# Altium schematic sheet USB_OTG_AND_HOST.SchDoc
size A3; SheetNumber: 2; SheetTotal: 20
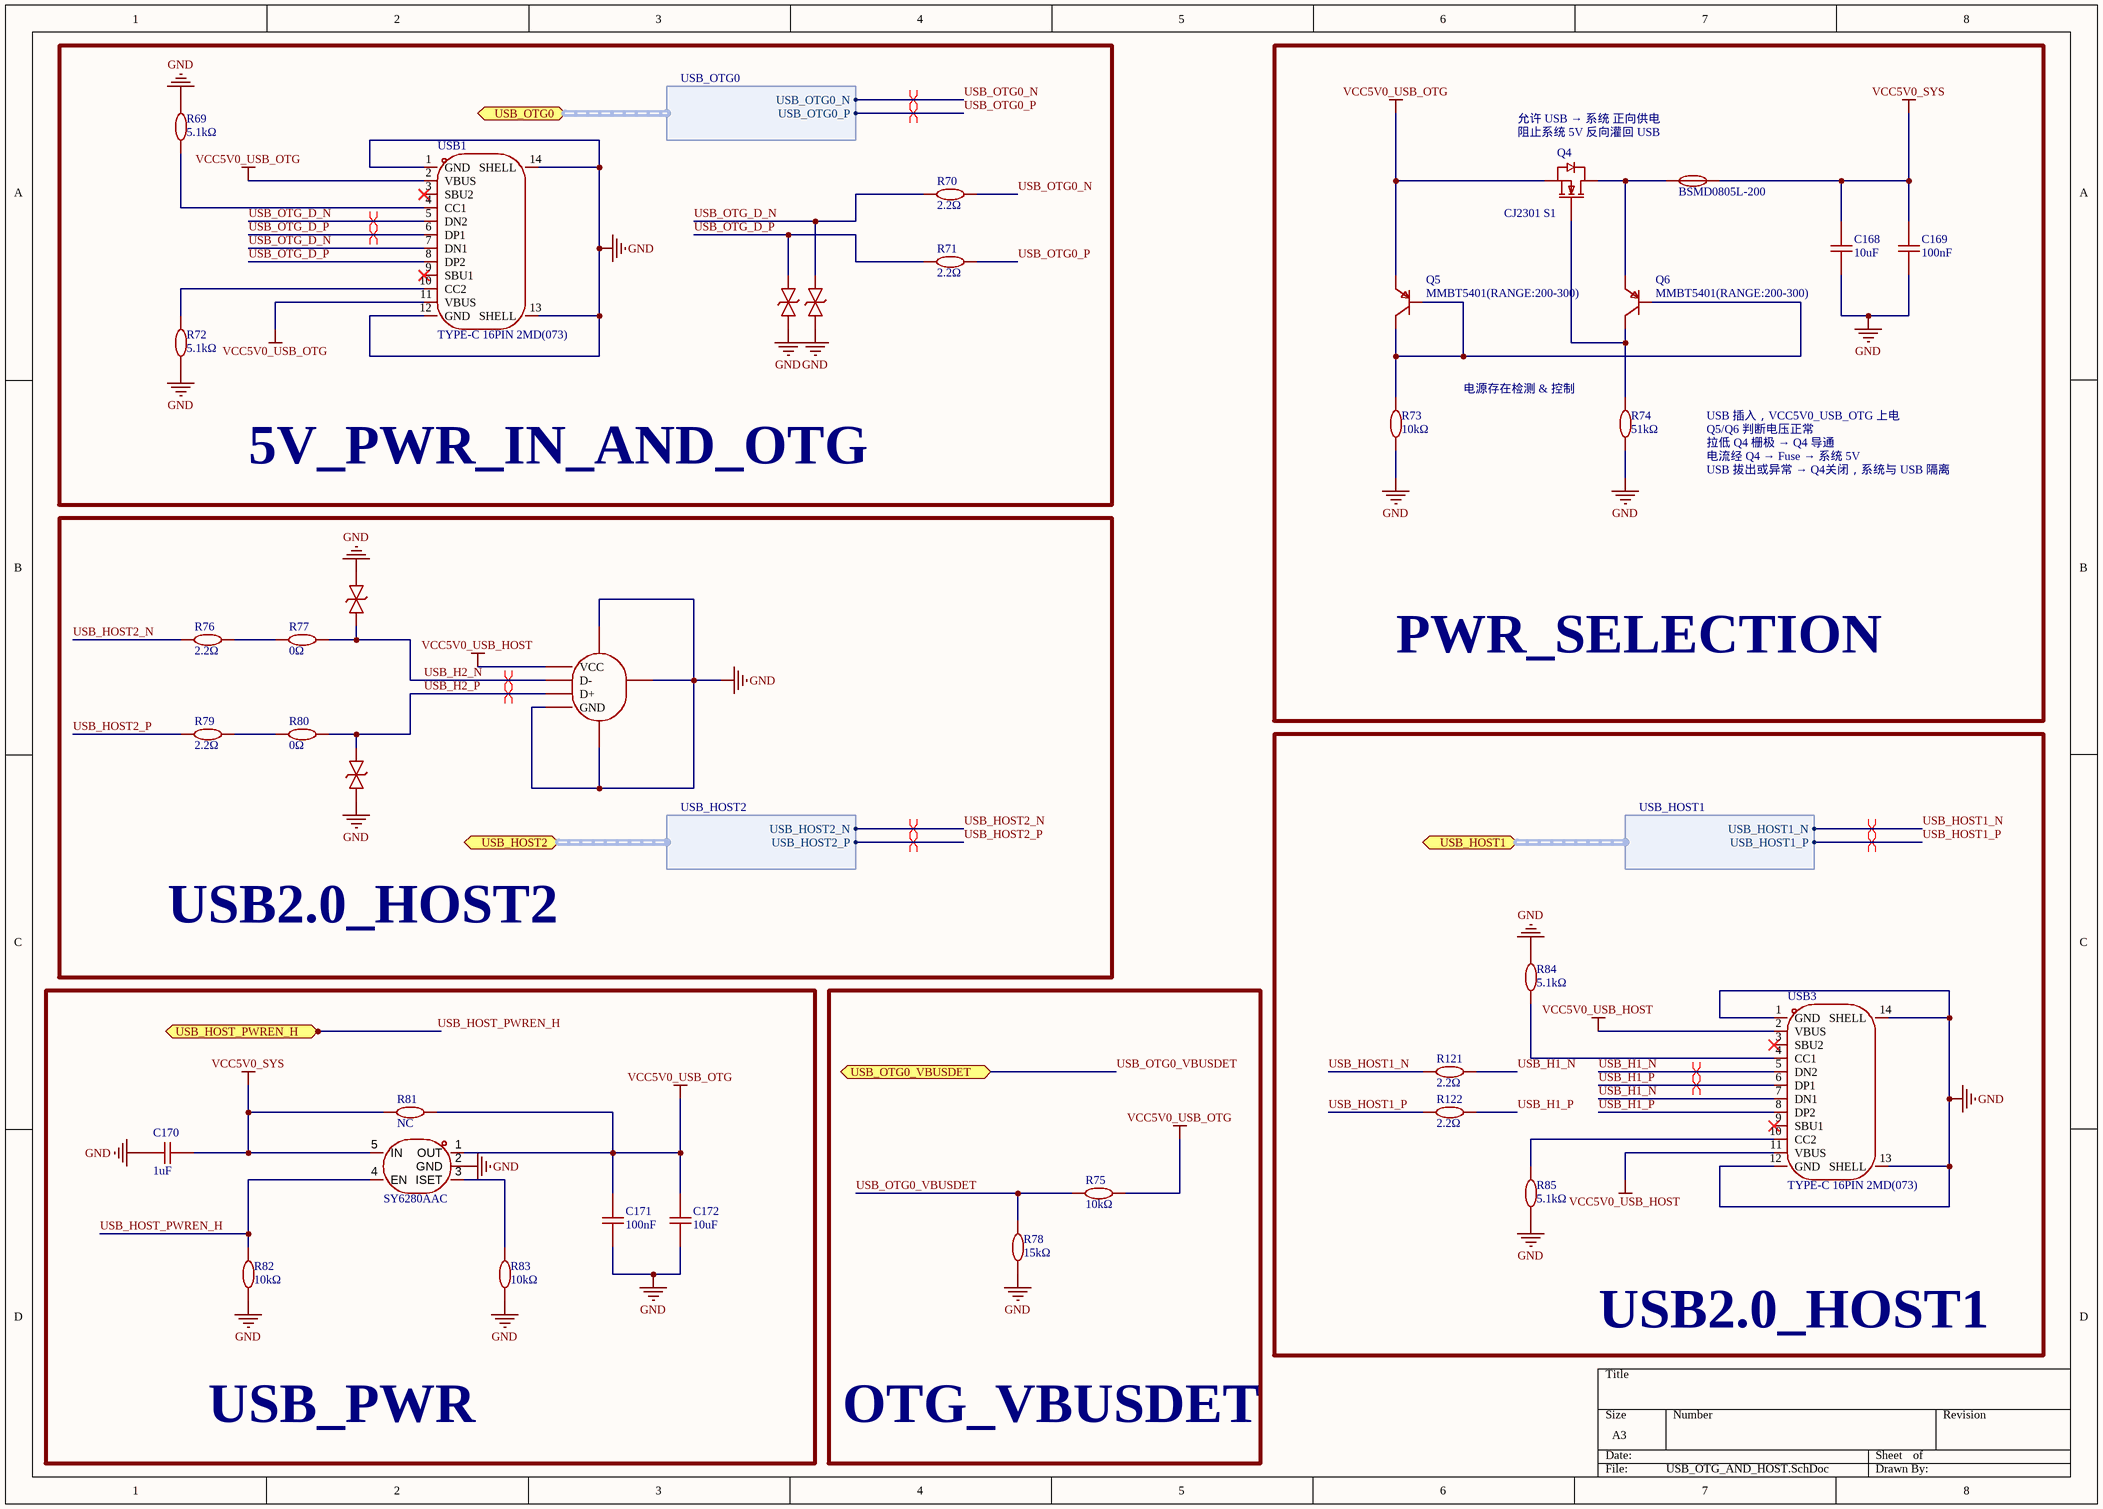
[diagram p0: USB_OTG_AND_HOST.SchDoc]

## Parts
C168  10uF  [C0603]
C169  100nF  [C0402]
C170  1uF  [C0402]
C171  100nF  [C0402]
C172  10uF  [C0603]
F1  BSMD0805L-200  [F0805]
Q4  CJ2301 S1  [SOT-23_L2.9-W1.3-P1.90-LS2.4-BR]
Q5  MMBT5401(RANGE:200-300)  [SOT-23_L2.9-W1.3-P1.90-LS2.4-BR]
Q6  MMBT5401(RANGE:200-300)  [SOT-23_L2.9-W1.3-P1.90-LS2.4-BR]
R69  5.1kΩ  [R0402]
R70  2.2Ω  [R0402]
R71  2.2Ω  [R0402]
R72  5.1kΩ  [R0402]
R73  10kΩ  [R0402]
R74  51kΩ  [R0402]
R75  10kΩ  [R0402]
R76  2.2Ω  [R0402]
R77  0Ω  [R0402]
R78  15kΩ  [R0402]
R79  2.2Ω  [R0402]
R80  0Ω  [R0402]
R81  NC  [R0402]
R82  10kΩ  [R0402]
R83  10kΩ  [R0402]
R84  5.1kΩ  [R0402]
R85  5.1kΩ  [R0402]
R121  2.2Ω  [R0402]
R122  2.2Ω  [R0402]
U29  ESD5451N  [DFN1006-2L-BI]  (value not drawn)
U30  ESD5451N  [DFN1006-2L-BI]  (value not drawn)
U31  ESD5451N  [DFN1006-2L-BI]  (value not drawn)
U32  ESD5451N  [DFN1006-2L-BI]  (value not drawn)
U33  SY6280AAC  [SOT-23-5_L3.0-W1.7-P0.95-LS2.8-BL]
USB1  TYPE-C 16PIN 2MD(073)  [USB-C-SMD_TYPE-C-6PIN-2MD-073]
USB2  AF 10.0 HC6.3  [USB-A-TH_AF-10.0-HC6.3]  (value not drawn)
USB3  TYPE-C 16PIN 2MD(073)  [USB-C-SMD_TYPE-C-6PIN-2MD-073]

## Blocks framed on the sheet
5V_PWR_IN_AND_OTG: R69-R72 U29 U30 USB1
PWR_SELECTION: C168 C169 F1 Q4-Q6 R73 R74
USB2.0_HOST2: R76 R77 R79 R80 U31 U32 USB2
USB2.0_HOST1: R84 R85 R121 R122 USB3
USB_PWR: C170-C172 R81-R83 U33
OTG_VBUSDET: R75 R78

## Ports
USB_HOST1 (bidir, harness USB_HOST1, see Overview[2B], RK3566[3C], RK3566_USB_GPIO[1B]), USB_HOST2 (bidir, harness USB_HOST2, see Overview[2C], RK3566[3C], RK3566_USB_GPIO[1A]), USB_HOST_PWREN_H (bidir, see Overview[2C], RK3566[3C], RK3566_USB_GPIO[1B]), USB_OTG0 (bidir, harness USB_OTG0, see Overview[2B], RK3566[3C], RK3566_USB_GPIO[1A]), USB_OTG0_VBUSDET (bidir, see Overview[2C], RK3566[3C], RK3566_USB_GPIO[1B])

## Harnesses
USB_OTG0: USB_OTG0_N, USB_OTG0_P
USB_HOST2: USB_HOST2_N, USB_HOST2_P
USB_HOST1: USB_HOST1_N, USB_HOST1_P

## Nets
GND: C168.1 C169.1 C170.1 C171.1 C172.1 R69.2 R72.1 R73.1 R74.1 R78.1 R82.1 R83.1 R84.2 R85.1 U29.1 U30.1 U31.2 U32.1 U33.2(GND) USB1.1(GND) USB1.12(GND) USB1.13(SHELL) USB1.14(SHELL) USB2.4(GND) USB2.5 USB2.6 USB2.7 USB3.1(GND) USB3.12(GND) USB3.13(SHELL) USB3.14(SHELL)
VCC5V0_SYS: C168.2 C169.2 C170.2 F1.2 R81.1 U33.5(IN)
VCC5V0_USB_HOST: USB2.1(VCC) USB3.2(VBUS) USB3.11(VBUS)
VCC5V0_USB_OTG: C171.2 C172.2 Q4.2(S) Q5.2(E) R75.2 R81.2 U33.1(OUT) USB1.2(VBUS) USB1.11(VBUS)
USB_H1_N: R121.2 USB3.5(DN2) USB3.7(DN1)
USB_H1_P: R122.2 USB3.6(DP1) USB3.8(DP2)
USB_H2_N: R77.2 U31.1 USB2.2(D-)
USB_H2_P: R80.2 U32.2 USB2.3(D+)
USB_HOST1_N: R121.1 ; port USB_HOST1.USB_HOST1_N
USB_HOST1_P: R122.1 ; port USB_HOST1.USB_HOST1_P
USB_HOST2_N: R76.1 ; port USB_HOST2.USB_HOST2_N
USB_HOST2_P: R79.1 ; port USB_HOST2.USB_HOST2_P
USB_HOST_PWREN_H: R82.2 U33.4(EN) ; port USB_HOST_PWREN_H
USB_OTG0_N: R70.2 ; port USB_OTG0.USB_OTG0_N
USB_OTG0_P: R71.2 ; port USB_OTG0.USB_OTG0_P
USB_OTG0_VBUSDET: R75.1 R78.2 ; port USB_OTG0_VBUSDET
USB_OTG_D_N: R70.1 U30.2 USB1.5(DN2) USB1.7(DN1)
USB_OTG_D_P: R71.1 U29.2 USB1.6(DP1) USB1.8(DP2)
NetF1_1: F1.1 Q4.3(D) Q6.2(E)
NetQ4_1: Q4.1(G) Q6.3(B) R74.2
NetQ5_1: Q5.1(B) Q5.3(B) Q6.1(B) R73.2
NetR69_1: R69.1 USB1.4(CC1)
NetR72_2: R72.2 USB1.10(CC2)
NetR76_2: R76.2 R77.1
NetR79_2: R79.2 R80.1
NetR83_2: R83.2 U33.3(ISET)
NetR84_1: R84.1 USB3.4(CC1)
NetR85_2: R85.2 USB3.10(CC2)

Not connected (* = marked no-connect by the designer): USB1 3(SBU2)* 9(SBU1)*; USB3 3(SBU2)* 9(SBU1)*

## Layout directives
differential pair: USB_H1_N, USB_H1_P, USB_H2_N, USB_H2_P, USB_HOST1_N, USB_HOST1_P, USB_HOST2_N, USB_HOST2_P, USB_OTG0_N, USB_OTG0_P, USB_OTG_D_N, USB_OTG_D_P

## Notes on the sheet
- 允许 USB → 系统 正向供电
- (near Q4) 阻止系统 5V 反向灌回 USB
- 电源存在检测 & 控制
- USB 插入，VCC5V0_USB_OTG 上电
- Q5/Q6 判断电压正常
- 拉低 Q4 栅极 → Q4 导通
- 电流经 Q4 → Fuse → 系统 5V
- USB 拔出或异常 → Q4关闭，系统与 USB 隔离

## Library data of the parts
C168 C172 = 10uF: 10V 10uF X5R ±10% 0603 Ceramic Capacitors ROHS
C169 C171 = 100nF: 50V 100nF X7R ±10% 0402 Ceramic Capacitors ROHS
C170 = 1uF: 50V 1uF X5R ±10% 0402 Ceramic Capacitors ROHS
F1 = BSMD0805L-200: 6V 2A 0805自恢复; Symbol: BSMD0805L-200
Q4 = CJ2301 S1: 1个P沟道 耐压:20V 电流:2.3A ,-20V,-2.3A,112mΩ@-4.5V
Q5 Q6 = MMBT5401(RANGE:200-300): PNP hfe=200~300 PNP 电流:0.6A 电压:150V
R69 R72 R84 R85 = 5.1kΩ: 5.1kΩ 62.5mW 50V ±100ppm/℃ Thick Film Resistor ±1% 0402 Chip Resistor - Surface Mount ROHS
R70 R71 R76 R79 R121 R122 = 2.2Ω: 小尺寸、重量轻。降低组装成本,与贴片机匹配。适用于波峰焊和回流焊
R73 R75 R82 R83 = 10kΩ: 62.5mW 10kΩ 50V ±100ppm/℃ Thick Film Resistor ±1% 0402 Chip Resistor - Surface Mount ROHS
R74 = 51kΩ: 51kΩ 62.5mW 50V ±100ppm/℃ Thick Film Resistor ±1% 0402 Chip Resistor - Surface Mount ROHS
R77 R80 = 0Ω: 0Ω 62.5mW 50V Thick Film Resistor ±1% 0402 Chip Resistor - Surface Mount ROHS
R78 = 15kΩ: 62.5mW 15kΩ 50V ±100ppm/℃ Thick Film Resistor ±1% 0402 Chip Resistor - Surface Mount ROHS
R81 = 10Ω: 10Ω 62.5mW 50V ±200ppm/℃ Thick Film Resistor ±1% 0402 Chip Resistor - Surface Mount ROHS
U29-U32 = ESD5451N_C5261080: 9A 9.8V 8V Bidirectional 5V DFN1006-2L TVS Diodes ROHS; Manufacturer: HXY MOSFET(华轩阳电子); Add into BOM: yes; Reverse Leakage Current (Ir): 500nA; Number of Channels: 1.0; level of protection: IEC 61000-4-2; Junction Capacitance: 15pF; Symbol: ESD5451N_C5261080; Device: ESD5451N_C5261080; LCSC Part Name: 5V 15pF 双向; Supplier Part: C5261080; Manufacturer Part: ESD5451N; Supplier Footprint: DFN1006-2L; JLCPCB Part Class: Extended Part; Datasheet: https://item.szlcsc.com/datasheet/ESD5451N/5983779.html; Supplier: LCSC; Convert to PCB: yes; Polarity: Bidirectional; Reverse Stand-Off Voltage (Vrwm): 5V; Clamping Voltage: 9.8V; Peak Pulse Current (Ipp): 9A; Voltage - Breakdown: 8V; Type: ESD
U33 = SY6280AAC: 低损耗功率分配开关; Symbol: SY6280AAC
USB1 USB3 = TYPE-C 16PIN 2MD(073): 16pin type-c
USB2 = AF 10.0 HC6.3: Type-A 母 弯插; Manufacturer: 精拓金; Symbol: AFSide of the three straight feet boundless copper14.0PBTWhite plastic90degree; Device: 906-162A1011D10200; Add into BOM: yes; Protocol Standard: USB 2.0; Gender: Female; Number of Contacts: 4P; Number of Ports: 1; Current Rating-Power: 2A; LCSC Part Name: Type-A 母 侧插; Supplier Part: C39417; Manufacturer Part: 906-162A1011D10200; Supplier Footprint: 插件; JLCPCB Part Class: Extended Part; Datasheet: https://item.szlcsc.com/datasheet/906-162A1011D10200/40400.html; Supplier: LCSC; Convert to PCB: yes; Connector Type: Type-A; Mounting Type: Vertical, Flag; Operating Temperature: -